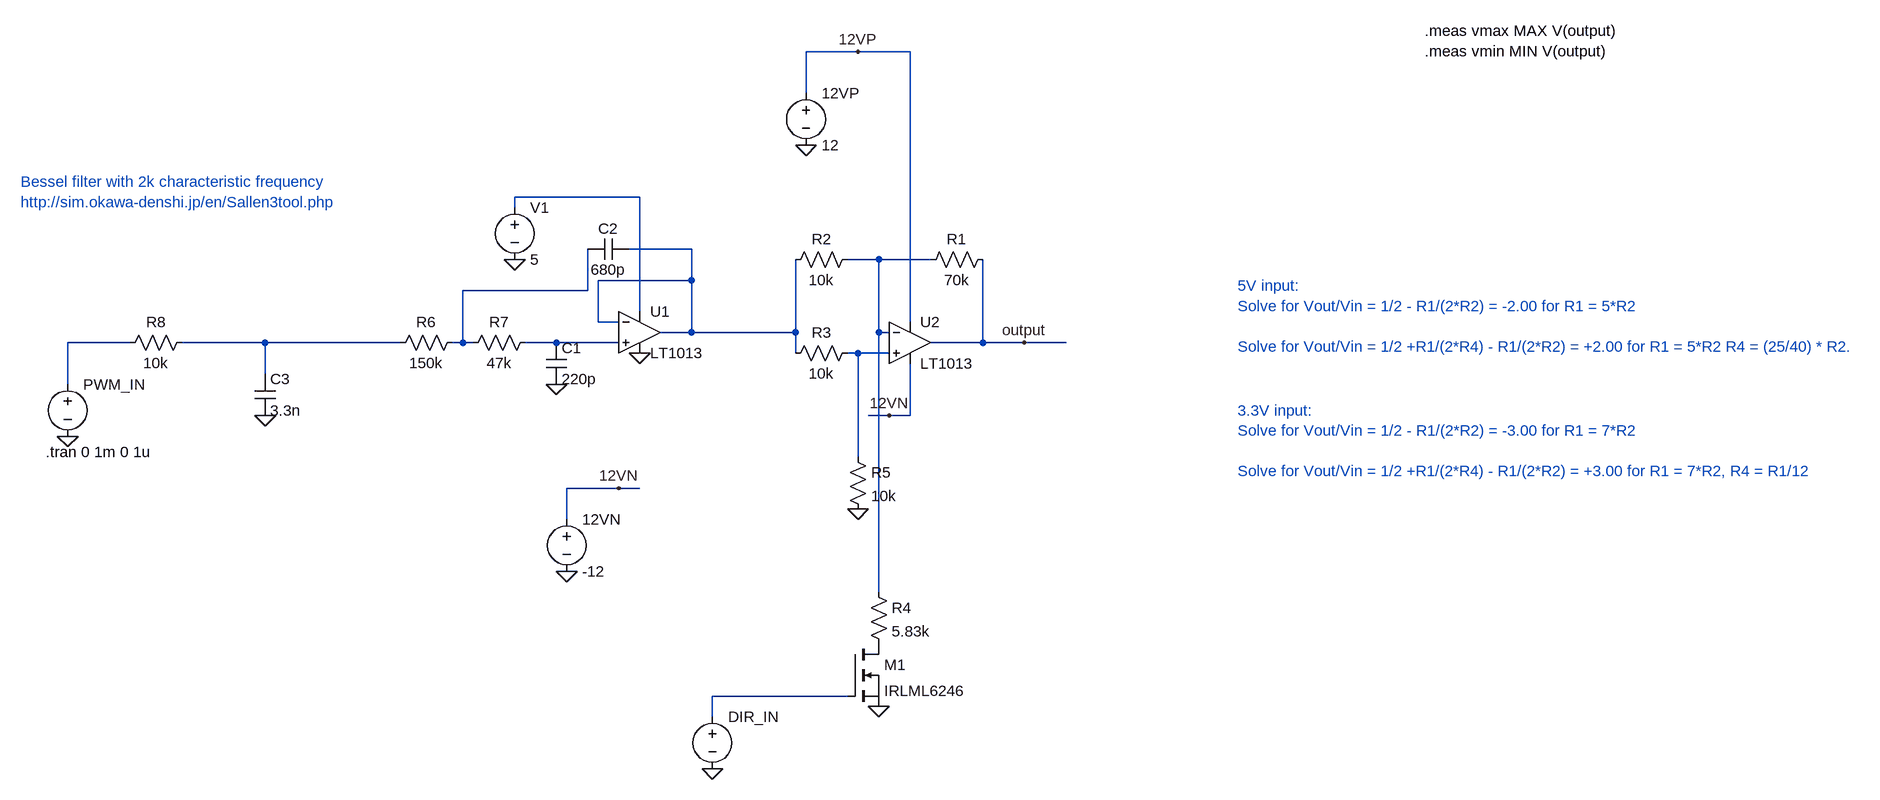
[diagram p0: schematic pwmdir-to-analog-nomux-sallen-key.asc]
pwmdir-to-analog-nomux-sallen-key.asc, the LTspice schematic file:
Version 4
SHEET 1 2836 756
WIRE 912 -368 832 -368
WIRE 992 -368 912 -368
WIRE 832 -304 832 -368
WIRE 576 -144 384 -144
WIRE 384 -128 384 -144
WIRE 656 -64 560 -64
WIRE 944 -48 896 -48
WIRE 1024 -48 944 -48
WIRE 656 -16 656 -64
WIRE 656 -16 512 -16
WIRE 496 0 496 -64
WIRE 496 0 304 0
WIRE 576 32 576 -144
WIRE 512 48 512 -16
WIRE 544 48 512 48
WIRE 992 48 992 -368
WIRE 656 64 656 -16
WIRE 656 64 608 64
WIRE 816 64 816 -48
WIRE 816 64 656 64
WIRE 944 64 944 -48
WIRE 960 64 944 64
WIRE -208 80 -304 80
WIRE 0 80 -128 80
WIRE 208 80 0 80
WIRE 304 80 304 0
WIRE 304 80 288 80
WIRE 320 80 304 80
WIRE 448 80 400 80
WIRE 544 80 448 80
WIRE 1104 80 1104 -48
WIRE 1104 80 1024 80
WIRE 1168 80 1104 80
WIRE 1232 80 1168 80
WIRE 816 96 816 64
WIRE 912 96 896 96
WIRE 960 96 912 96
WIRE 0 128 0 80
WIRE -304 144 -304 80
WIRE 960 192 928 192
WIRE 992 192 992 112
WIRE 992 192 960 192
WIRE 912 256 912 96
WIRE 544 304 464 304
WIRE 576 304 544 304
WIRE 464 352 464 304
WIRE 944 464 944 64
WIRE 896 624 688 624
WIRE 688 656 688 624
FLAG -304 224 0
FLAG 384 -48 0
FLAG 576 96 0
FLAG 832 -224 0
FLAG 464 432 0
FLAG 912 -368 12VP
FLAG 544 304 12VN
FLAG 960 192 12VN
FLAG 912 336 0
FLAG 688 736 0
FLAG 944 640 0
FLAG 1168 80 output
FLAG 448 144 0
FLAG 0 192 0
SYMBOL voltage -304 128 R0
WINDOW 3 24 96 Invisible 2
WINDOW 123 0 0 Left 0
WINDOW 39 0 0 Left 0
SYMATTR InstName PWM_IN
SYMATTR Value PULSE(0 3.3 0 10n 10n 5u 10u)
SYMBOL OpAmps\\LT1013 576 0 R0
SYMATTR InstName U1
SYMBOL voltage 384 -144 R0
WINDOW 123 0 0 Left 0
WINDOW 39 0 0 Left 0
SYMATTR InstName V1
SYMATTR Value 5
SYMBOL OpAmps\\LT1013 992 16 R0
SYMATTR InstName U2
SYMBOL voltage 832 -320 R0
WINDOW 123 0 0 Left 0
WINDOW 39 0 0 Left 0
SYMATTR InstName 12VP
SYMATTR Value 12
SYMBOL voltage 464 336 R0
WINDOW 123 0 0 Left 0
WINDOW 39 0 0 Left 0
SYMATTR InstName 12VN
SYMATTR Value -12
SYMBOL voltage 688 640 R0
WINDOW 3 24 96 Invisible 2
WINDOW 123 0 0 Left 0
WINDOW 39 0 0 Left 0
SYMATTR InstName DIR_IN
SYMATTR Value PULSE(0 3.3 0.5m 10n 10n 1m 1m)
SYMBOL res 912 80 R90
WINDOW 0 0 56 VBottom 2
WINDOW 3 32 56 VTop 2
SYMATTR InstName R3
SYMATTR Value 10k
SYMBOL res 896 240 R0
SYMATTR InstName R5
SYMATTR Value 10k
SYMBOL res 912 -64 R90
WINDOW 0 0 56 VBottom 2
WINDOW 3 32 56 VTop 2
SYMATTR InstName R2
SYMATTR Value 10k
SYMBOL res 928 448 R0
SYMATTR InstName R4
SYMATTR Value 5.83k
SYMBOL nmos 896 544 R0
SYMATTR InstName M1
SYMATTR Value IRLML6246
SYMBOL res 1120 -64 R90
WINDOW 0 0 56 VBottom 2
WINDOW 3 32 56 VTop 2
SYMATTR InstName R1
SYMATTR Value 70k
SYMBOL res 304 64 R90
WINDOW 0 0 56 VBottom 2
WINDOW 3 32 56 VTop 2
SYMATTR InstName R6
SYMATTR Value 150k
SYMBOL res 416 64 R90
WINDOW 0 0 56 VBottom 2
WINDOW 3 32 56 VTop 2
SYMATTR InstName R7
SYMATTR Value 47k
SYMBOL cap 432 80 R0
SYMATTR InstName C1
SYMATTR Value 220p
SYMBOL cap 560 -80 R90
WINDOW 0 0 32 VBottom 2
WINDOW 3 32 32 VTop 2
SYMATTR InstName C2
SYMATTR Value 680p
SYMBOL res -112 64 R90
WINDOW 0 0 56 VBottom 2
WINDOW 3 32 56 VTop 2
SYMATTR InstName R8
SYMATTR Value 10k
SYMBOL cap -16 128 R0
SYMATTR InstName C3
SYMATTR Value 3.3n
TEXT -338 248 Left 2 !.tran 0 1m 0 1u
TEXT 1784 -400 Left 2 !.meas vmax MAX V(output)\n.meas vmin MIN V(output)
TEXT 1496 -8 Left 2 ;5V input:\nSolve for Vout/Vin = 1/2 - R1/(2*R2) = -2.00 for R1 = 5*R2\n \nSolve for Vout/Vin = 1/2 +R1/(2*R4) - R1/(2*R2) = +2.00 for R1 = 5*R2 R4 = (25/40) * R2.
TEXT 1496 184 Left 2 ;3.3V input:\nSolve for Vout/Vin = 1/2 - R1/(2*R2) = -3.00 for R1 = 7*R2\n \nSolve for Vout/Vin = 1/2 +R1/(2*R4) - R1/(2*R2) = +3.00 for R1 = 7*R2, R4 = R1/12
TEXT -376 -168 Left 2 ;Bessel filter with 2k characteristic frequency\nhttp://sim.okawa-denshi.jp/en/Sallen3tool.php

The netlist it stands for:
* pwmdir-to-analog-nomux-sallen-key.asc
V§PWM_IN N005 0 PULSE(0 3.3 0 10n 10n 5u 10u)
XU1 N007 N002 N001 0 N002 LT1013  ; pins In+ In- V+ V- OUT
V1 N001 0 5
XU2 N008 N003 12VP 12VN output LT1013  ; pins In+ In- V+ V- OUT
V§12VP 12VP 0 12
V§12VN 12VN 0 -12
V§DIR_IN N009 0 PULSE(0 3.3 0.5m 10n 10n 1m 1m)
R3 N008 N002 10k
R5 N008 0 10k
R2 N003 N002 10k
R4 N003 P001 5.83k
M1 P001 N009 0 0 IRLML6246
R1 output N003 70k
R6 N004 N006 150k
R7 N007 N004 47k
C1 N007 0 220p
C2 N002 N004 680p
R8 N006 N005 10k
C3 N006 0 3.3n
.model NMOS NMOS
.model PMOS PMOS
.lib standard.mos
.tran 0 1m 0 1u
.meas vmax MAX V(output)
.meas vmin MIN V(output)
* 5V input:
* Solve for Vout/Vin = 1/2 - R1/(2*R2) = -2.00 for R1 = 5*R2
* Solve for Vout/Vin = 1/2 +R1/(2*R4) - R1/(2*R2) = +2.00 for R1 = 5*R2 R4 = (25/40) * R2.
* 3.3V input:
* Solve for Vout/Vin = 1/2 - R1/(2*R2) = -3.00 for R1 = 7*R2
* Solve for Vout/Vin = 1/2 +R1/(2*R4) - R1/(2*R2) = +3.00 for R1 = 7*R2, R4 = R1/12
* Bessel filter with 2k characteristic frequency
* http://sim.okawa-denshi.jp/en/Sallen3tool.php
.lib LTC.lib
.backanno
.end